# EAGLE design jduino_mini (EAGLE 5.06)
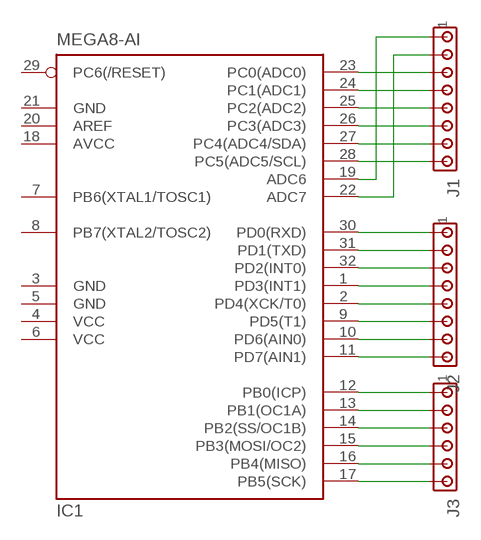
[diagram p0: schematic, sheet 1]

## Parts
IC1  MEGA8-AI  [TQFP32-08]
J1  MTA08-100  [10X08MTA]
J2  MTA08-100  [10X08MTA]
J3  MTA06-100  [10X06MTA]

## Nets
N$1: IC1.17(PB5(SCK)) J3.1
N$2: IC1.16(PB4(MISO)) J3.2
N$3: IC1.15(PB3(MOSI/OC2)) J3.3
N$4: IC1.14(PB2(SS/OC1B)) J3.4
N$5: IC1.13(PB1(OC1A)) J3.5
N$6: IC1.12(PB0(ICP)) J3.6
N$7: IC1.11(PD7(AIN1)) J2.8
N$8: IC1.10(PD6(AIN0)) J2.7
N$9: IC1.9(PD5(T1)) J2.6
N$10: IC1.2(PD4(XCK/T0)) J2.5
N$11: IC1.1(PD3(INT1)) J2.4
N$12: IC1.32(PD2(INT0)) J2.3
N$13: IC1.31(PD1(TXD)) J2.2
N$14: IC1.30(PD0(RXD)) J2.1
N$15: IC1.28(PC5(ADC5/SCL)) J1.8
N$16: IC1.27(PC4(ADC4/SDA)) J1.7
N$17: IC1.26(PC3(ADC3)) J1.6
N$18: IC1.25(PC2(ADC2)) J1.5
N$19: IC1.24(PC1(ADC1)) J1.4
N$20: IC1.23(PC0(ADC0)) J1.3
N$21: IC1.19(ADC6) J1.1
N$22: IC1.22(ADC7) J1.2
Unconnected: IC1.7(PB6(XTAL1/TOSC1)) IC1.8(PB7(XTAL2/TOSC2)) IC1.20(AREF) IC1.29(PC6(/RESET))

## Power pins joined to a net without a drawn wire
AVCC: IC1.18(AVCC)
GND: IC1.3(GND) IC1.5(GND) IC1.21(GND)
VCC: IC1.4(VCC) IC1.6(VCC)

## Library data of the parts
IC1 = atmel:MEGA8: MICROCONTROLLER 8 Kbytes FLASH, 1 kbytes SRAM, 512 bytes EEPROM, USART, 6-channel 10 bit ADC, 2-channel 8 bit ADC Pin compatible with Atmega48, ATMega88, ATMega168 Source: avr.lbr
J1 J2 = con-amp:MTA08-100: AMP connector
J3 = con-amp:MTA06-100: AMP connector

## Board
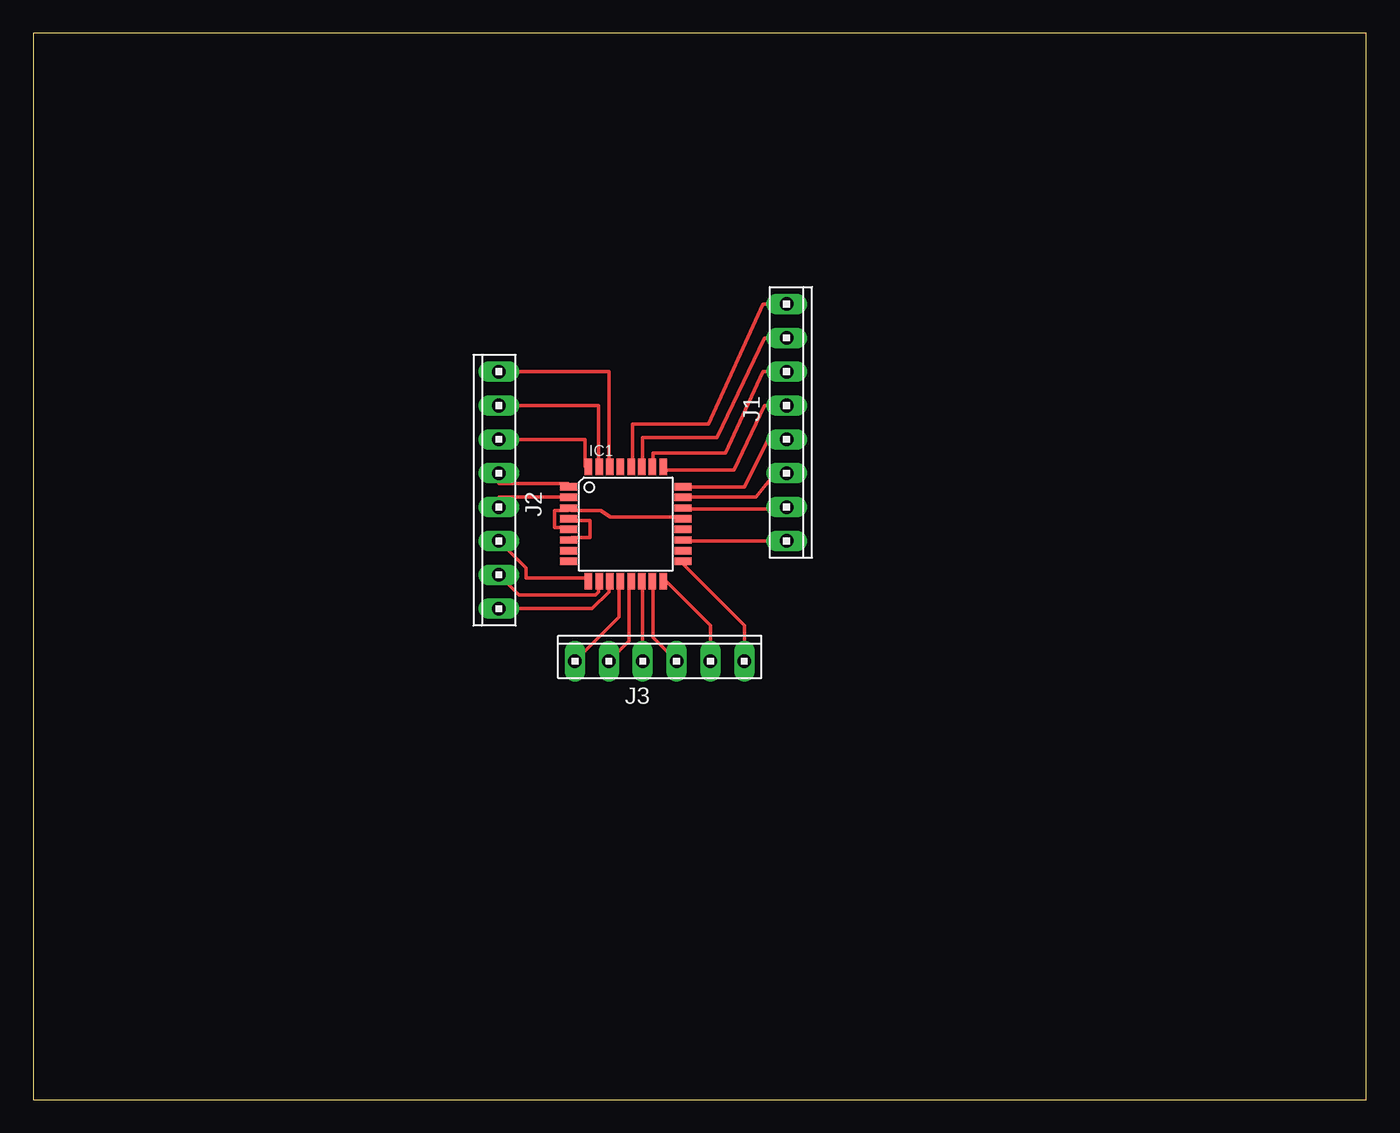
[diagram p1: board, top side]

Size 100 x 80 mm. Coordinates in mm from the lower left corner, seen from the top.
Outline: 0,0 100,0 100,80 0,80 0,0
Copper layers (1*16): Top 0.035mm / dielectric 1.5mm / Bottom 0.035mm
Design rules "default": minimum track width 10mil, minimum drill 24mil, track to track 8mil, track to pad 8mil, pad to pad 8mil, via to via 8mil, smd to smd 8mil, copper to edge 40mil, drill to drill 8mil, minimum pad ring 10mil, minimum via ring 8mil, stop-mask expansion 4mil, vias tented up to drill 0mil, thermal gap 10mil

### Footprints (pad centres in the part's own frame; a part is rotated, then mirrored left to right if it is on the bottom)
TQFP32-08 = smd 1.27 x 0.559: 1 -4.293,2.8; 2 -4.293,2; 3 -4.293,1.2; 4 -4.293,0.4; 5 -4.293,-0.4; 6 -4.293,-1.2; 7 -4.293,-2; 8 -4.293,-2.8; 17 4.293,-2.8; 18 4.293,-2; 19 4.293,-1.2; 20 4.293,-0.4; 21 4.293,0.4; 22 4.293,1.2; 23 4.293,2; 24 4.293,2.8 | smd 0.559 x 1.27: 9 -2.8,-4.293; 10 -2,-4.293; 11 -1.2,-4.293; 12 -0.4,-4.293; 13 0.4,-4.293; 14 1.2,-4.293; 15 2,-4.293; 16 2.8,-4.293; 25 2.8,4.293; 26 2,4.293; 27 1.2,4.293; 28 0.4,4.293; 29 -0.4,4.293; 30 -1.2,4.293; 31 -2,4.293; 32 -2.8,4.293
10X08MTA = drill 1.016 long: 1 8.89,0; 2 6.35,0; 3 3.81,0; 4 1.27,0; 5 -1.27,0; 6 -3.81,0; 7 -6.35,0; 8 -8.89,0
10X06MTA = drill 1.016 long: 1 6.35,0; 2 3.81,0; 3 1.27,0; 4 -1.27,0; 5 -3.81,0; 6 -6.35,0

### Placement (x,y rotation side)
IC1  44.45,43.18 0 top
J1  56.52,50.8 270 top
J2  34.92,45.72 90 top
J3  46.99,32.89 0 top

### Tracks (layer width: path | path; a pad name or v marks a point on that pad's centre or on a via)
GND
  Top 0.254: IC1.5 40.13,42.93 39.12,42.93 39.12,44.2 40.13,44.2 IC1.3 40.39,44.2 42.55,44.2 43.31,43.69 48.51,43.69 IC1.21
N$1
  Top 0.254: J3.1 53.34,35.56 48.77,40.13 IC1.17
N$2
  Top 0.254: J3.2 50.8,35.56 47.5,38.86 IC1.16
N$3
  Top 0.254: J3.3 46.48,34.67 46.48,38.86 IC1.15
N$4
  Top 0.254: J3.4 45.72,39.37 IC1.14
N$5
  Top 0.254: J3.5 44.7,34.42 44.7,38.86 IC1.13
N$6
  Top 0.254: J3.6 43.94,36.2 43.94,38.86 IC1.12
N$7
  Top 0.254: J2.8 41.91,36.83 43.18,38.1 43.18,39.37 IC1.11
N$8
  Top 0.254: J2.7 36.45,37.85 42.16,37.85 42.42,38.1 42.42,38.86 IC1.10
N$9
  Top 0.254: J2.6 36.96,39.88 36.96,39.12 41.4,39.12 IC1.9
N$10
  Top 0.254: J2.5 34.92,45.21 40.13,45.21 IC1.2
N$11
  Top 0.254: J2.4 34.92,46.23 40.13,46.23 IC1.1
N$12
  Top 0.254: J2.3 41.4,49.53 41.4,47.5 IC1.32
N$13
  Top 0.254: J2.2 42.42,52.07 42.42,47.5 IC1.31
N$14
  Top 0.254: J2.1 43.18,54.61 43.18,46.99 IC1.30
N$15
  Top 0.254: J1.8 54.74,59.69 50.67,50.67 44.96,50.67 44.96,47.5 IC1.28
N$16
  Top 0.254: J1.7 54.86,57.15 51.31,49.66 45.72,49.66 45.72,46.99 IC1.27
N$17
  Top 0.254: J1.6 54.74,54.61 51.94,48.51 46.48,48.51 46.48,47.5 IC1.26
N$18
  Top 0.254: J1.5 54.86,52.07 52.58,47.24 47.5,47.24 IC1.25
N$19
  Top 0.254: J1.4 55.12,49.53 53.34,45.97 48.77,45.97 IC1.24
N$20
  Top 0.254: J1.3 55.12,47.12 55.75,47.12 54.23,45.21 48.77,45.21 IC1.23
N$21
  Top 0.254: J1.1 48.26,41.91 IC1.19
N$22
  Top 0.254: J1.2 55.24,44.32 49.28,44.32 IC1.22
VCC
  Top 0.254: IC1.6 40.39,42.16 41.78,42.16 41.78,43.43 40.39,43.43 IC1.4